# Altium schematic sheet Uart.SchDoc
size A4
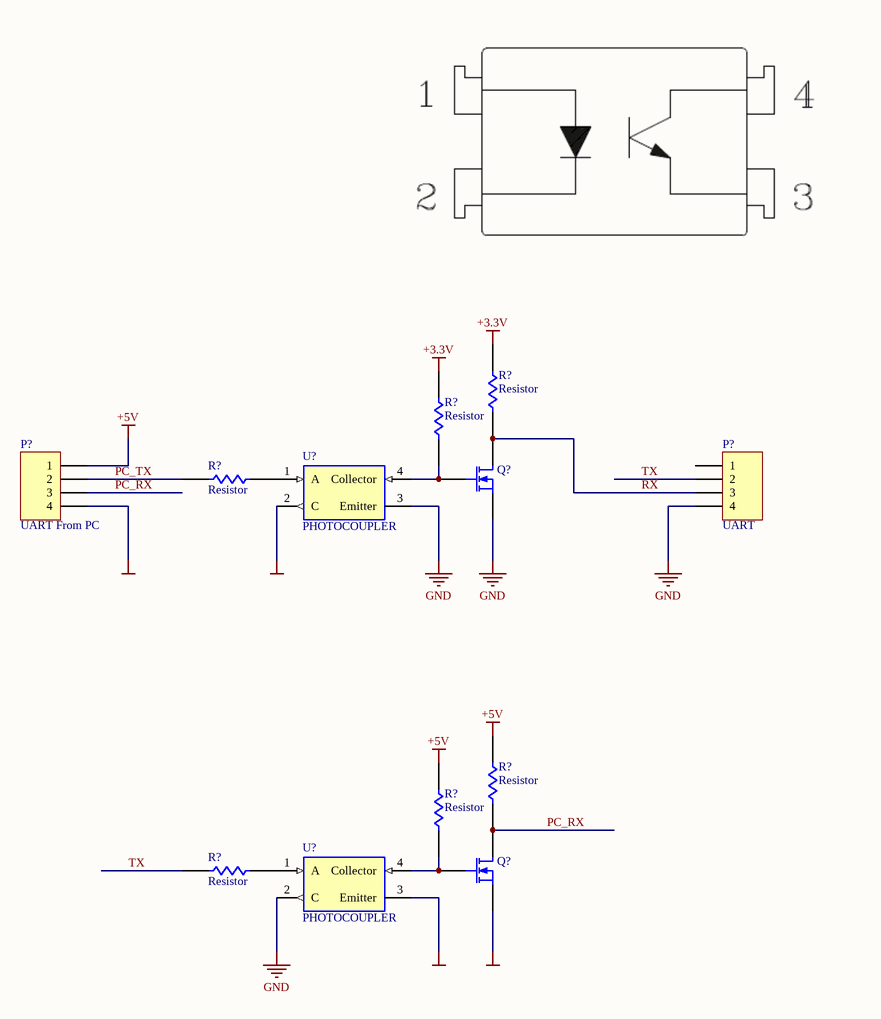
[diagram p0: Uart.SchDoc]

## Parts
(Parts that share a designator on the sheet are numbered #1, #2 ... from top to bottom, then left to right.)
P?#1  UART From PC  [PIN_TOP_SMALL_4]
P?#2  UART  [PIN_TOP_SMALL_4]
Q?#1  MOSFET-N  [E3]  (value not drawn)
Q?#2  MOSFET-N  [E3]  (value not drawn)
R?#1  Resistor  [6-0805_M]
R?#2  Resistor  [6-0805_M]
R?#3  Resistor  [6-0805_M]
R?#4  Resistor  [6-0805_M]
R?#5  Resistor  [6-0805_M]
R?#6  Resistor  [6-0805_M]
U?#1  PHOTOCOUPLER  [SOT23-5_M]
U?#2  PHOTOCOUPLER  [SOT23-5_M]

## Nets
+3.3V: R?#1.1 R?#2.1
+5V: P?#1.1 R?#4.1 R?#5.1
GND: P?#1.4 P?#2.4 Q?#1.3(S) Q?#2.3(S) U?#1.2(C) U?#1.3(Emitter) U?#2.2(C) U?#2.3(Emitter)
PC_RX: P?#1.3 Q?#2.1(D) R?#4.2
PC_TX: P?#1.2 R?#3.2
RX: P?#2.3 Q?#1.1(D) R?#1.2
TX: P?#2.2 R?#6.2
NetQ?#1_2: Q?#1.2(G) R?#2.2 U?#1.4(Collector)
NetQ?#2_2: Q?#2.2(G) R?#5.2 U?#2.4(Collector)
NetR?#3_1: R?#3.1 U?#1.1(A)
NetR?#6_1: R?#6.1 U?#2.1(A)

Not connected (* = marked no-connect by the designer): P?#2 1

## Library data of the parts
P?#1 P?#2 = Header TOP 4: Header, 1Pin; LatestRevisionDate: 17-Jul-2002; LatestRevisionNote: Re-released for DXP Platform.; Publisher: Altium Limited
Q?#1 Q?#2 = MOSFET-N: N-Channel MOSFET; Published: 8-Jun-2000; LatestRevisionDate: 17-Jul-2002; LatestRevisionNote: Re-released for DXP Platform.; PackageVersion: 1995/1996; PackageReference: E3; Publisher: Altium Limited; PackageDescription: TO, Flat Index; 3 In-Line, Axial Leads; Body Dia. 4.6mm; Lead Dia. 0.5 mm (max)
U?#1 U?#2 = K1010: Published: 24-Mar-1999; LatestRevisionDate: 17-Jul-2002; LatestRevisionNote: Re-released for DXP Platform.; PackageReference: DIP-6; Publisher: Altium Limited; Code_JEDEC: MO-001-AM
R?#1-R?#6 = Resistor: Published: 24-Mar-1999; LatestRevisionDate: 29-May-2009; LatestRevisionNote: IPC-7351 Footprint Added.; PackageVersion: Mar-2003; PackageReference: 6-0805; Publisher: Altium Limited; PackageDescription: Chip Resistor 0805 Case Size; Code_IPC: RESC2012